# EAGLE schematic Lamp (EAGLE 7.7.0)
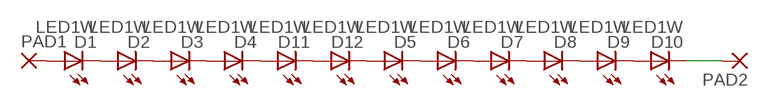
[diagram p0: schematic, sheet 1]

## Parts
D1  LED1W  [LED-1W]
D2  LED1W  [LED-1W]
D3  LED1W  [LED-1W]
D4  LED1W  [LED-1W]
D5  LED1W  [LED-1W]
D6  LED1W  [LED-1W]
D7  LED1W  [LED-1W]
D8  LED1W  [LED-1W]
D9  LED1W  [LED-1W]
D10  LED1W  [LED-1W]
D11  LED1W  [LED-1W]
D12  LED1W  [LED-1W]
PAD1  3,81/1,4  [3,81/1,4]
PAD2  3,81/1,4  [3,81/1,4]

## Nets
N$1: D1.K(C) D2.A
N$2: D2.K(C) D3.A
N$3: D3.K(C) D4.A
N$4: D4.K(C) D11.A
N$5: D5.K(C) D6.A
N$6: D6.K(C) D7.A
N$7: D7.K(C) D8.A
N$8: D8.K(C) D9.A
N$9: D9.K(C) D10.A
N$10: D1.A PAD1.1(P)
N$11: D10.K(C) PAD2.1(P)
N$12: D11.K(C) D12.A
N$13: D5.A D12.K(C)

## Library data of the parts
D1-D12 = Namenlos:LED
PAD1 PAD2 = wirepad:3,81/1,4: THROUGH-HOLE PAD